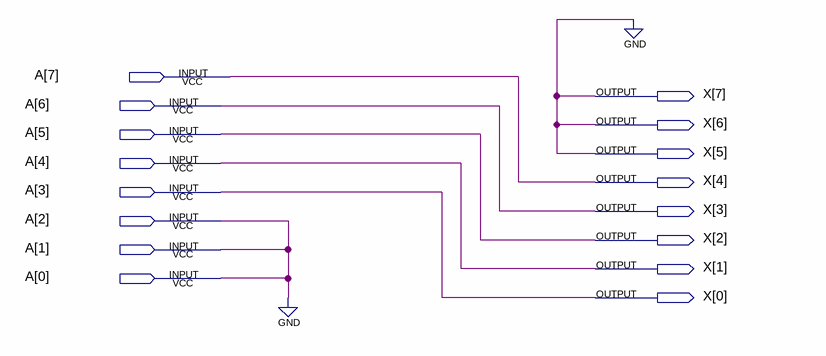
[diagram p0: schematic sheet]
// Quartus schematic CORR3.bdf as structural Verilog: 0 symbols, 16 pins
module CORR3 (
  input  [7:0] A,
  output [7:0] X
);


  assign A[1:0] = {2{A[2]}};
  assign X = {3'b000, A[7:3]};
  // also tied to GND on the sheet: A[2]
endmodule
